# EAGLE schematic SatNOGSBoardV1_1 (EAGLE 6.4)
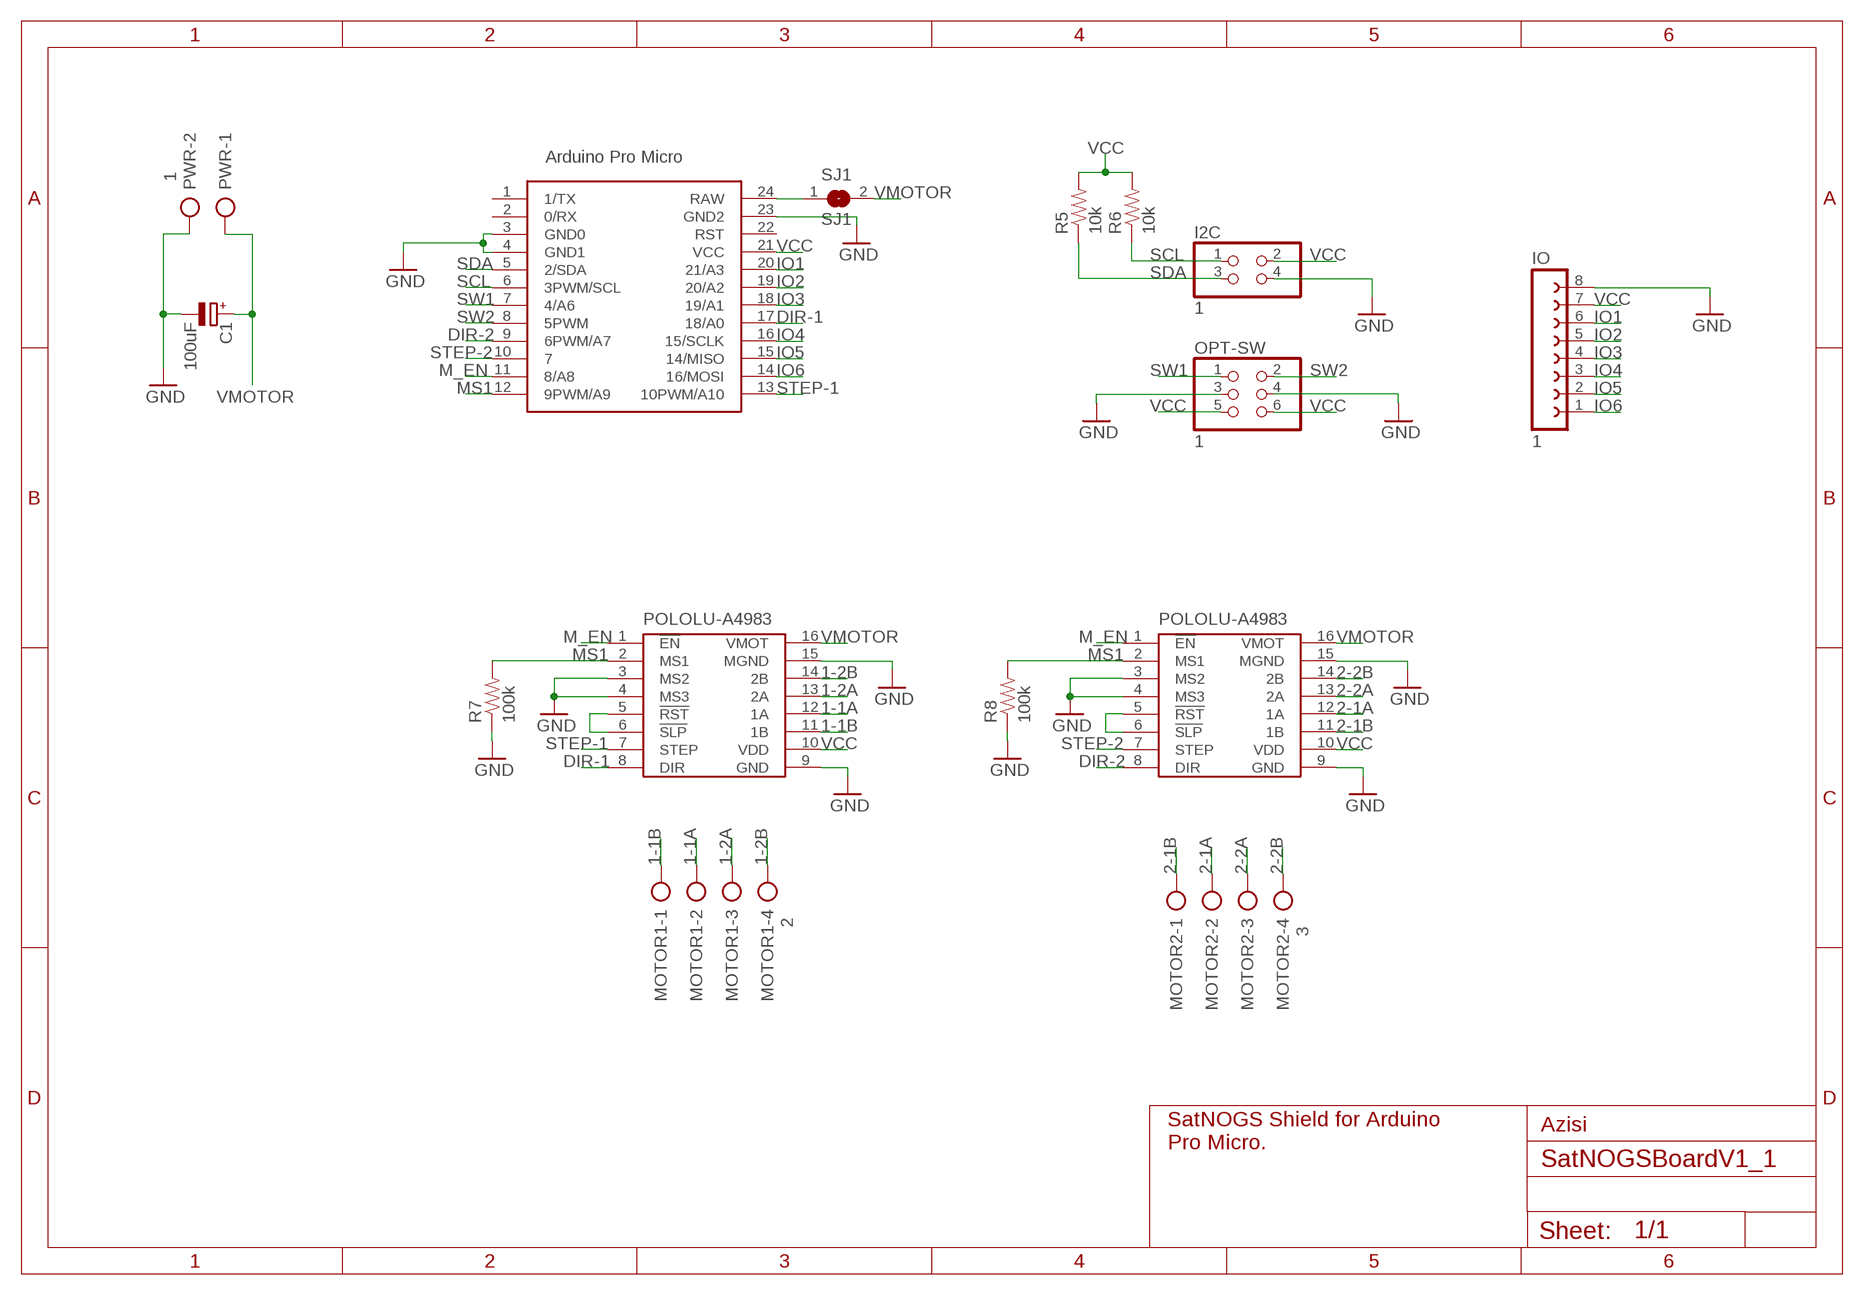
[diagram p0: schematic, sheet 1]

## Parts
C1  100uF  CPOL-EUE2.5-6  [E2,5-6]
DRIVER1  POLOLU-A4983POLOLU-A4983  [POLOLU-A4983]
DRIVER2  POLOLU-A4983POLOLU-A4983  [POLOLU-A4983]
I2C  1  PINHD-2X2/90  [2X02/90]
IO  1  FE08-1  [FE08]
MOTOR1  2  AK500/4  [AK500/4]
MOTOR2  3  AK500/4  [AK500/4]
OPT-SW  1  PINHD-2X3/90  [2X03/90]
PWR  1  AK500/2  [AK500/2]
R5  10k  RESISTORPTH-1/4W  [AXIAL-0.4]
R6  10k  RESISTORPTH-1/4W  [AXIAL-0.4]
R7  100k  RESISTORPTH-1/4W  [AXIAL-0.4]
R8  100k  RESISTORPTH-1/4W  [AXIAL-0.4]
SJ1  SJ1  SJW  [SJW]
UC  ARDUINO_PRO_MICROARDUINO_BOARD  [ARDUINO_MICRO_PRO]

## Nets
1-1A: DRIVER1.12(1A) MOTOR1.2
1-1B: DRIVER1.11(1B) MOTOR1.1
1-2A: DRIVER1.13(2A) MOTOR1.3
1-2B: DRIVER1.14(2B) MOTOR1.4
2-1A: DRIVER2.12(1A) MOTOR2.2
2-1B: DRIVER2.11(1B) MOTOR2.1
2-2A: DRIVER2.13(2A) MOTOR2.3
2-2B: DRIVER2.14(2B) MOTOR2.4
DIR-1: DRIVER1.8(DIR) UC.17(18/A0)
DIR-2: DRIVER2.8(DIR) UC.9(6PWM/A7)
GND: C1.- DRIVER1.3(MS2) DRIVER1.4(MS3) DRIVER1.9(GND) DRIVER1.15(MGND) DRIVER2.3(MS2) DRIVER2.4(MS3) DRIVER2.9(GND) DRIVER2.15(MGND) I2C.4 IO.8 OPT-SW.3 OPT-SW.4 PWR.2 R7.P$1 R8.P$1 UC.3(GND0) UC.4(GND1) UC.23(GND2)
IO1: IO.6 UC.20(21/A3)
IO2: IO.5 UC.19(20/A2)
IO3: IO.4 UC.18(19/A1)
IO4: IO.3 UC.16(15/SCLK)
IO5: IO.2 UC.15(14/MISO)
IO6: IO.1 UC.14(16/MOSI)
M_EN: DRIVER1.1(!EN) DRIVER2.1(!EN) UC.11(8/A8)
MS1: DRIVER1.2(MS1) DRIVER2.2(MS1) R7.P$2 R8.P$2 UC.12(9PWM/A9)
N$1: DRIVER1.5(!RST) DRIVER1.6(!SLP)
N$2: DRIVER2.5(!RST) DRIVER2.6(!SLP)
N$3: SJ1.1 UC.24(RAW)
SCL: I2C.1 R6.P$1 UC.6(3PWM/SCL)
SDA: I2C.3 R5.P$1 UC.5(2/SDA)
STEP-1: DRIVER1.7(STEP) UC.13(10PWM/A10)
STEP-2: DRIVER2.7(STEP) UC.10
SW1: OPT-SW.1 UC.7(4/A6)
SW2: OPT-SW.2 UC.8(5PWM)
VCC: DRIVER1.10(VDD) DRIVER2.10(VDD) I2C.2 IO.7 OPT-SW.5 OPT-SW.6 R5.P$2 R6.P$2 UC.21(VCC)
VMOTOR: C1.+ DRIVER1.16(VMOT) DRIVER2.16(VMOT) PWR.1 SJ1.2
Unconnected: UC.1(1/TX) UC.2(0/RX) UC.22(RST)

## Notes on the sheet
- Azisi
- SatNOGS Shield for Arduino
  Pro Micro.

## Library data of the parts
C1 = rcl:CPOL-EU: POLARIZED CAPACITOR, European symbol
DRIVER1 DRIVER2 = Pololu-A4983:POLOLU-A4983
I2C = pinhead:PINHD-2X2: PIN HEADER
IO = con-lsta:FE08-1: FEMALE HEADER; OC_FARNELL: unknown; OC_NEWARK: unknown
MOTOR1 MOTOR2 = con-ptr500:AK500/4: CONNECTOR; OC_FARNELL: unknown; OC_NEWARK: unknown
OPT-SW = pinhead:PINHD-2X3: PIN HEADER
PWR = con-ptr500:AK500/2: CONNECTOR; OC_FARNELL: unknown; OC_NEWARK: unknown
R5-R8 = SparkFun-Resistors:RESISTOR: Resistor Basic schematic elements and footprints for 0603, 1206, and PTH resistors.
SJ1 = jumper:SJ: SMD solder JUMPER
UC = Arduino_Pro_Micro:ARDUINO_PRO_MICRO